# Altium schematic sheet Piggyback Harness.SchDoc
size A4
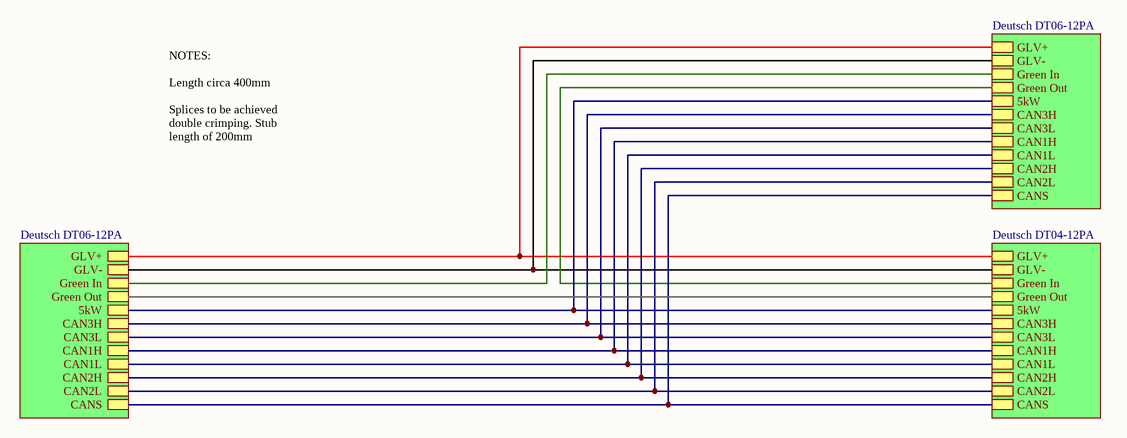
[diagram p0: Piggyback Harness.SchDoc]

## Sub-sheets
Deutsch DT04-12PA = File Name: GLV+, GLV-, CAN1H, CAN3H, CAN3L, CAN2H, CAN1L, CAN2L, CANS, Green Out, Green In, 5kW
Deutsch DT06-12PA = File Name: GLV+, GLV-, CAN1H, CAN3H, CAN3L, CAN2H, CAN1L, CAN2L, CANS, Green Out, Green In, 5kW
Deutsch DT06-12PA = File Name: GLV+, GLV-, CAN1H, CAN3H, CAN3L, CAN2H, CAN1L, CAN2L, CANS, Green Out, Green In, 5kW

## Nets
(unnamed): sheet Deutsch DT06-12PA/GLV+, sheet Deutsch DT04-12PA/GLV+, sheet Deutsch DT06-12PA/GLV+
(unnamed): sheet Deutsch DT06-12PA/GLV-, sheet Deutsch DT04-12PA/GLV-, sheet Deutsch DT06-12PA/GLV-
(unnamed): sheet Deutsch DT06-12PA/CAN1H, sheet Deutsch DT04-12PA/CAN1H, sheet Deutsch DT06-12PA/CAN1H
(unnamed): sheet Deutsch DT06-12PA/CAN3H, sheet Deutsch DT04-12PA/CAN3H, sheet Deutsch DT06-12PA/CAN3H
(unnamed): sheet Deutsch DT06-12PA/CAN3L, sheet Deutsch DT04-12PA/CAN3L, sheet Deutsch DT06-12PA/CAN3L
(unnamed): sheet Deutsch DT06-12PA/CAN2H, sheet Deutsch DT04-12PA/CAN2H, sheet Deutsch DT06-12PA/CAN2H
(unnamed): sheet Deutsch DT06-12PA/CAN1L, sheet Deutsch DT04-12PA/CAN1L, sheet Deutsch DT06-12PA/CAN1L
(unnamed): sheet Deutsch DT06-12PA/CAN2L, sheet Deutsch DT04-12PA/CAN2L, sheet Deutsch DT06-12PA/CAN2L
(unnamed): sheet Deutsch DT06-12PA/CANS, sheet Deutsch DT04-12PA/CANS, sheet Deutsch DT06-12PA/CANS
(unnamed): sheet Deutsch DT06-12PA/Green Out, sheet Deutsch DT04-12PA/Green Out
(unnamed): sheet Deutsch DT06-12PA/Green In, sheet Deutsch DT06-12PA/Green In
(unnamed): sheet Deutsch DT06-12PA/5kW, sheet Deutsch DT04-12PA/5kW, sheet Deutsch DT06-12PA/5kW
(unnamed): sheet Deutsch DT04-12PA/Green In, sheet Deutsch DT06-12PA/Green Out

## Notes on the sheet
- NOTES:
  Length circa 400mm
  Splices to be achieved double crimping. Stub length of 200mm